# Altium schematic sheet power.SchDoc
size A3
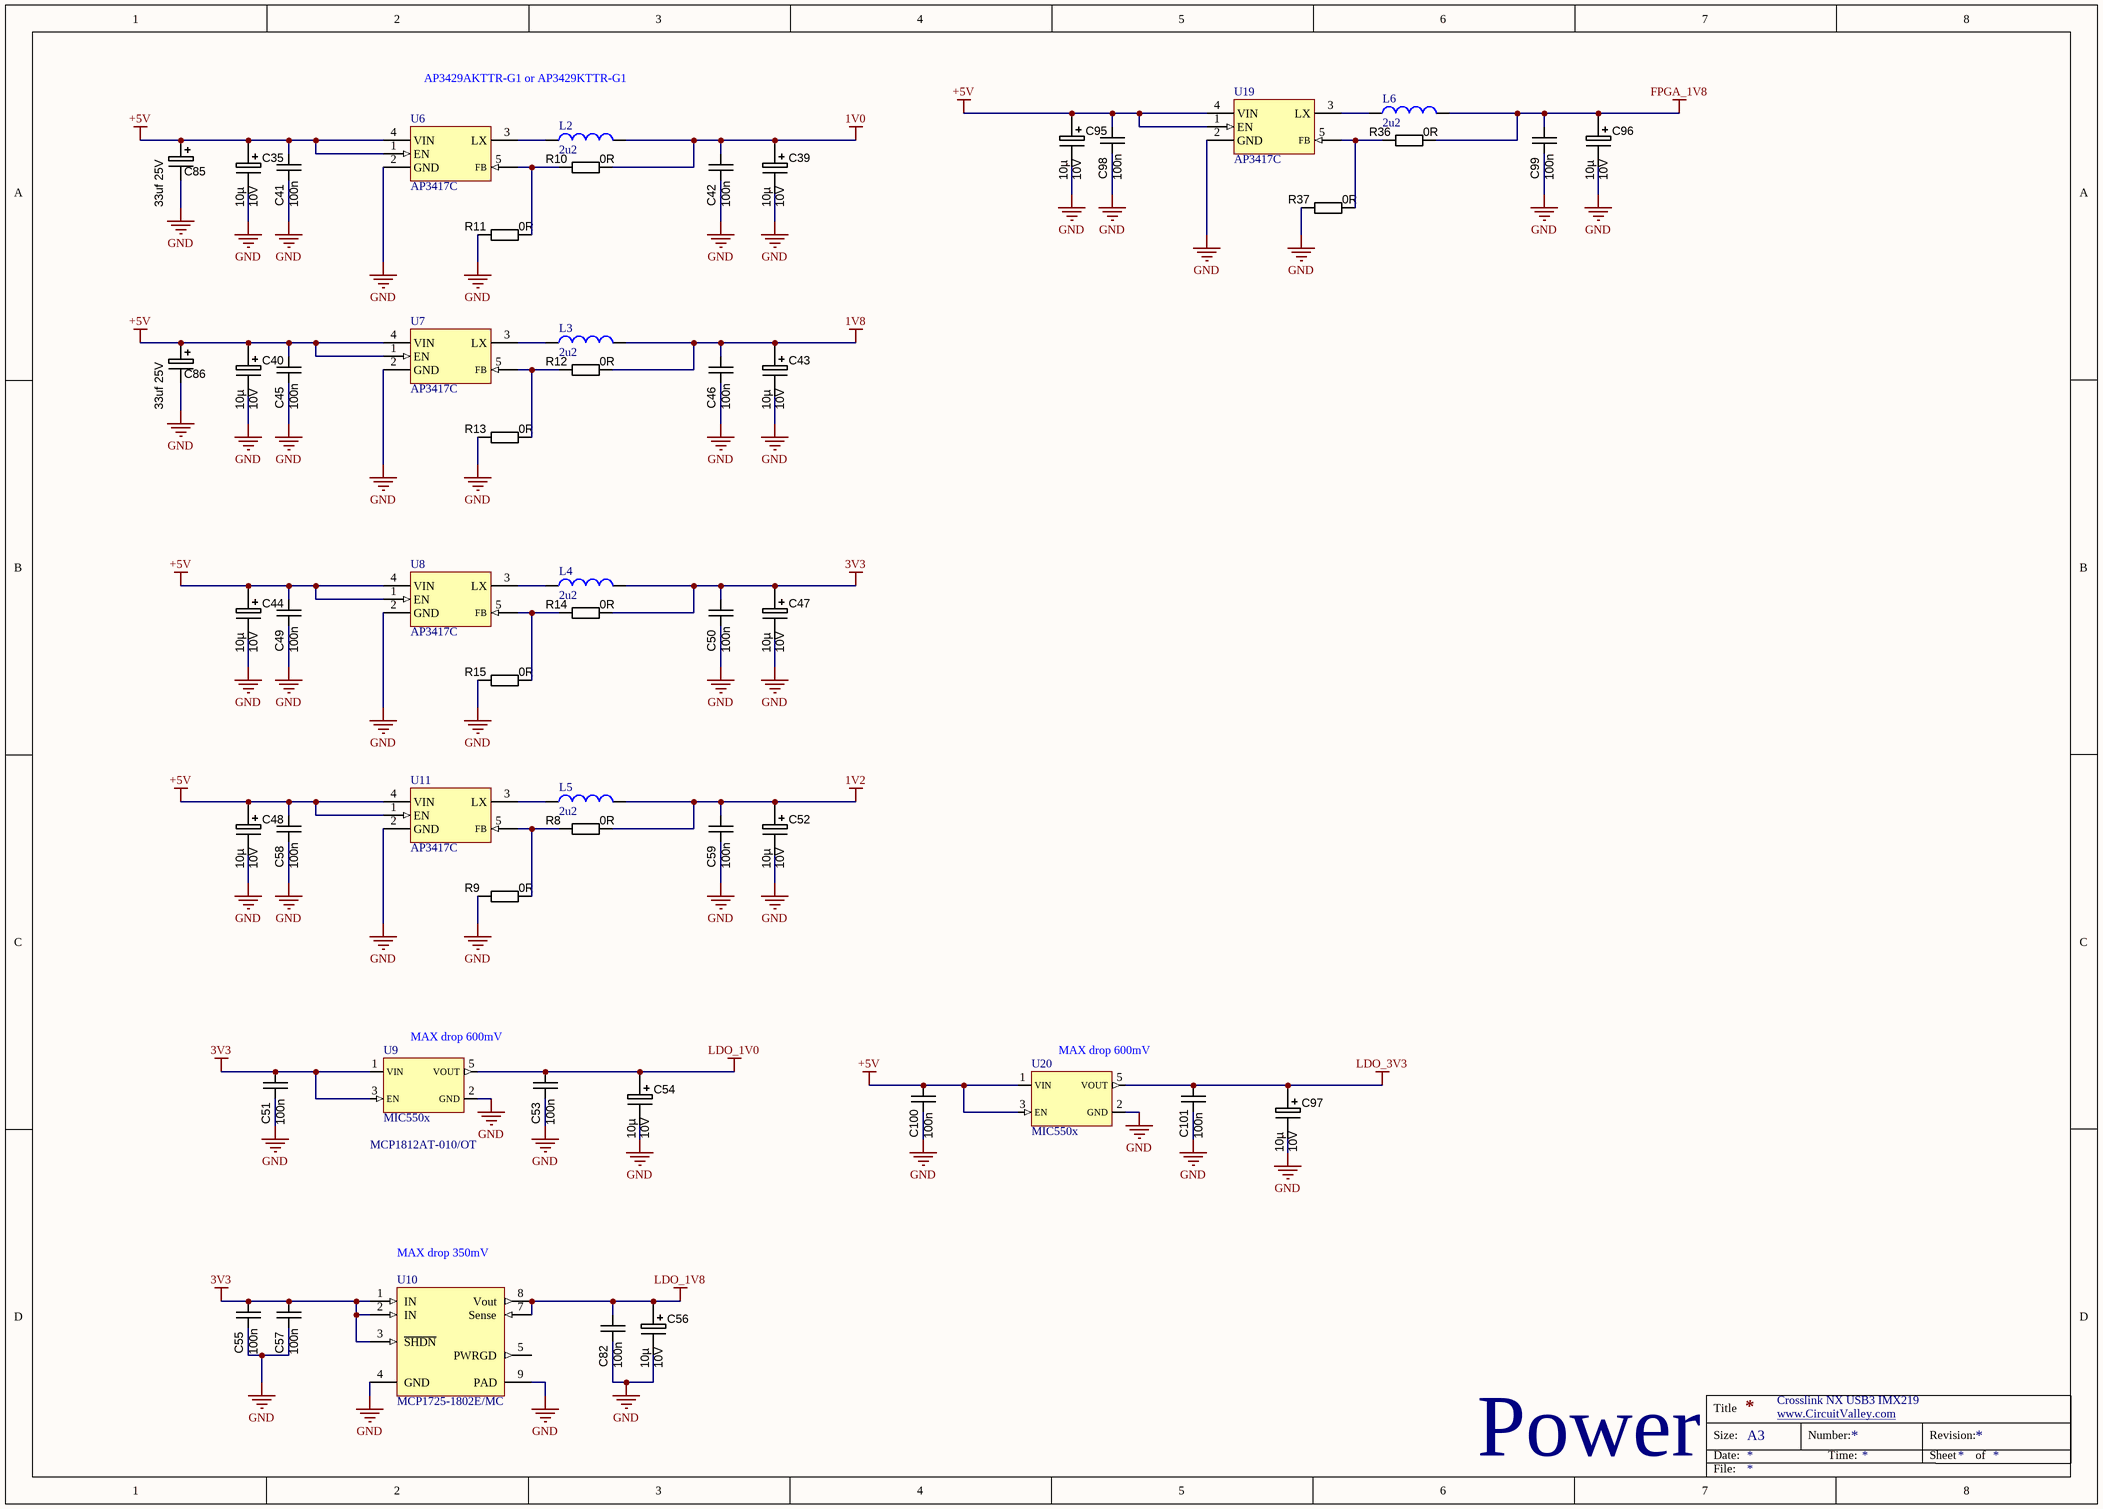
[diagram p0: power.SchDoc]

## Parts
C35  Ratings: 10V  [CAPMP3528X210N]  (hidden comment: 10µ)
C39  Ratings: 10V  [CAPMP3528X210N]  (hidden comment: 10µ)
C40  Ratings: 10V  [CAPMP3528X210N]  (hidden comment: 10µ)
C41  100n  [CAPC1608N]
C42  100n  [CAPC1608N]
C43  Ratings: 10V  [CAPMP3528X210N]  (hidden comment: 10µ)
C44  Ratings: 10V  [CAPMP3528X210N]  (hidden comment: 10µ)
C45  100n  [CAPC1608N]
C46  100n  [CAPC1608N]
C47  Ratings: 10V  [CAPMP3528X210N]  (hidden comment: 10µ)
C48  Ratings: 10V  [CAPMP3528X210N]  (hidden comment: 10µ)
C49  100n  [CAPC1608N]
C50  100n  [CAPC1608N]
C51  100n  [CAPC1608N]
C52  Ratings: 10V  [CAPMP3528X210N]  (hidden comment: 10µ)
C53  100n  [CAPC1608N]
C54  Ratings: 10V  [CAPMP3528X210N]  (hidden comment: 10µ)
C55  100n  [CAPC1608N]
C56  Ratings: 10V  [CAPMP3528X210N]  (hidden comment: 10µ)
C57  100n  [CAPC1608N]
C58  100n  [CAPC1608N]
C59  100n  [CAPC1608N]
C82  100n  [CAPC1608N]
C85  value 33uf 25V  [CAPMP7343X310N]  (hidden comment: 33uf 20V D)
C86  value 33uf 25V  [CAPMP7343X310N]  (hidden comment: 33uf 20V D)
C95  Ratings: 10V  [CAPMP3528X210N]  (hidden comment: 10µ)
C96  Ratings: 10V  [CAPMP3528X210N]  (hidden comment: 10µ)
C97  Ratings: 10V  [CAPMP3528X210N]  (hidden comment: 10µ)
C98  100n  [CAPC1608N]
C99  100n  [CAPC1608N]
C100  100n  [CAPC1608N]
C101  100n  [CAPC1608N]
L2  2u2  [TAIYO_NRS4018T2R2MDGJ]
L3  2u2  [TAIYO_NRS4018T2R2MDGJ]
L4  2u2  [TAIYO_NRS4018T2R2MDGJ]
L5  2u2  [TAIYO_NRS4018T2R2MDGJ]
L6  2u2  [TAIYO_NRS4018T2R2MDGJ]
R8  value 0R  [RESC1608N_ZERO]  (hidden comment: Thick Film)
R9  value 0R  [RESC1608N_ZERO]  (hidden comment: Thick Film)
R10  value 0R  [RESC1608N_ZERO]  (hidden comment: Thick Film)
R11  value 0R  [RESC1608N_ZERO]  (hidden comment: Thick Film)
R12  value 0R  [RESC1608N_ZERO]  (hidden comment: Thick Film)
R13  value 0R  [RESC1608N_ZERO]  (hidden comment: Thick Film)
R14  value 0R  [RESC1608N_ZERO]  (hidden comment: Thick Film)
R15  value 0R  [RESC1608N_ZERO]  (hidden comment: Thick Film)
R36  value 0R  [RESC1608N_ZERO]  (hidden comment: Thick Film)
R37  value 0R  [RESC1608N_ZERO]  (hidden comment: Thick Film)
U6  AP3417C  [SOT23-5]
U7  AP3417C  [SOT23-5]
U8  AP3417C  [SOT23-5]
U9  MIC550x  [SOT23-5]
U10  MCP1725-1802E/MC  [DFN8_3x2]
U11  AP3417C  [SOT23-5]
U19  AP3417C  [SOT23-5]
U20  MIC550x  [SOT23-5]

## Nets
1V0: C39.1 C42.2 L2.2 R10.1
1V2: C52.1 C59.2 L5.2 R8.1
1V8: C43.1 C46.2 L3.2 R12.1
3V3: C47.1 C50.2 C51.2 C55.2 C57.2 L4.2 R14.1 U9.1(VIN) U9.3(EN) U10.1(IN) U10.2(IN) U10.3(~{SHDN})
+5V: C35.1 C40.1 C41.2 C44.1 C45.2 C48.1 C49.2 C58.2 C85.1 C86.1 C95.1 C98.2 C100.2 U6.1(EN) U6.4(VIN) U7.1(EN) U7.4(VIN) U8.1(EN) U8.4(VIN) U11.1(EN) U11.4(VIN) U19.1(EN) U19.4(VIN) U20.1(VIN) U20.3(EN)
FPGA_1V8: C96.1 C99.2 L6.2 R36.1
GND: C35.2 C39.2 C40.2 C41.1 C42.1 C43.2 C44.2 C45.1 C46.1 C47.2 C48.2 C49.1 C50.1 C51.1 C52.2 C53.1 C54.2 C55.1 C56.2 C57.1 C58.1 C59.1 C82.1 C85.2 C86.2 C95.2 C96.2 C97.2 C98.1 C99.1 C100.1 C101.1 R9.2 R11.2 R13.2 R15.2 R37.2 U6.2(GND) U7.2(GND) U8.2(GND) U9.2(GND) U10.4(GND) U10.9(PAD) U11.2(GND) U19.2(GND) U20.2(GND)
LDO_1V0: C53.2 C54.1 U9.5(VOUT)
LDO_1V8: C56.1 C82.2 U10.7(Sense) U10.8(Vout)
LDO_3V3: C97.1 C101.2 U20.5(VOUT)
NetL2_1: L2.1 U6.3(LX)
NetL3_1: L3.1 U7.3(LX)
NetL4_1: L4.1 U8.3(LX)
NetL5_1: L5.1 U11.3(LX)
NetL6_1: L6.1 U19.3(LX)
NetR8_2: R8.2 R9.1 U11.5(FB)
NetR10_2: R10.2 R11.1 U6.5(FB)
NetR12_2: R12.2 R13.1 U7.5(FB)
NetR14_2: R14.2 R15.1 U8.5(FB)
NetR36_2: R36.2 R37.1 U19.5(FB)

Not connected (* = marked no-connect by the designer): U10 5(PWRGD)

## Notes on the sheet
- AP3429AKTTR-G1 or AP3429KTTR-G1
- (near U9) MAX drop 600mV
- (near U20) MAX drop 600mV
- (near U9) MCP1812AT-010/OT
- (near U10) MAX drop 350mV
- Crosslink NX USB3 IMX219
- www.CircuitValley.com <http://www.CircuitValley.com>
- Power
- Title
- Size:
- Date:
- A3
- Number:
- Time:
- Revision:
- Sheet
- of
- File:

## Library data of the parts
C35 C39 C40 C43 C44 C47 C48 C52 C54 C56 C95-C97 = CAPT_47u_1210_6V3: Capacitor SMD Tantalum 47uF 20% 6.3V 1210; Manufacturer 1: AVX Corporation; Manufacturer Part Number 1: TCJB476M006R0070; Manufacturer Size Code: B; Voltage - Rated: 6V3; ESR (Equivalent Series Resistance): 70.0 mOhm; Type: Molded; Package / Case: 1210 (3528 Metric); Tolerance: ±20%; Material: Tantalum; Supplier 1: Digi-Key; Supplier Part Number 1: 478-3139-1-ND; Operating Temperature: -55°C ~ 125°C; Size / Dimension: 0.138" L x 0.110" W (3.50mm x 2.80mm); Height - Seated (Max): 0.083" (2.10mm); ComponentLink1URL: http://www.avx.com/docs/Catalogs/tcj.pdf; ComponentLink1Description: http://www.avx.com/docs/Catalogs/tcj.pdf; Value: 10µ
C41 C42 C45 C46 C49-C51 C53 C55 C57-C59 C82 C98-C101 = CAPC_10p_0603_NP0_1%_50V: Capacitor SMD Cer 10pF 5% 50V NP0 0603; Manufacturer 1: Murata Electronics North America; Manufacturer Part Number 1: GRM1885C1H100FA01J; Part: C0603X104K5RAC; Ratings: 50V; NP0; Tolerance: ±5%; Operating Temperature: -55°C ~ 125°C; Package / Case: 0603 (1608 Metric); Size / Dimension: 0.063" L x 0.032" W (1.60mm x 0.81mm); Thickness (Max): 0.035" (0.90mm); Supplier 1: Digi-Key; Supplier Part Number 1: GRM1885C1H100FA01J-ND; Value: 100n
C85 C86 = CAPT_330u_2917_6V3: Capacitor SMD Tant 330uF 20% 6V3 2917; Manufacturer Part Number: T520D337M006ATE015; Part: TAJD336K020R; Ratings: 6.3V; Material: Solid Tantalum; ESR (Equivalent Series Resistance): 15 mOhm; Package / Case: 2917 (7343 Metric); Tolerance: ±20%; Operating Temperature: -55°C ~ 125°C; Size / Dimension: 0.287" L x 0.169" W (7.30mm x 4.30mm); Height - Seated (Max): 0.122" (3.10mm); Manufacturer Size Code: D; Supplier 1: Digi-Key; Supplier Part Number 1: 399-4052-1-ND; ComponentLink1URL: http://www.kemet.com/datasheets&T520D337M006ATE015; ComponentLink1Description: T520D Datasheet
L2-L6 = inductor_smd: PartNumber: NRS4018T2R2MDGJ
R8-R15 R36 R37 = RES_0R_0603: Resistor SMD chip 0.0 Ohm 0.1W 0603; Manufacturer 1: Vishay/Dale; Manufacturer Part Number 1: CRCW06030000Z0EA; Tolerance: ±5%; Ratings: 1/10W; Package / Case: 0603 (1608metric); Supplier 1: Digi-Key; Supplier Part Number 1: 541-0.0GCT-ND
U10 = MCP1725: LDO